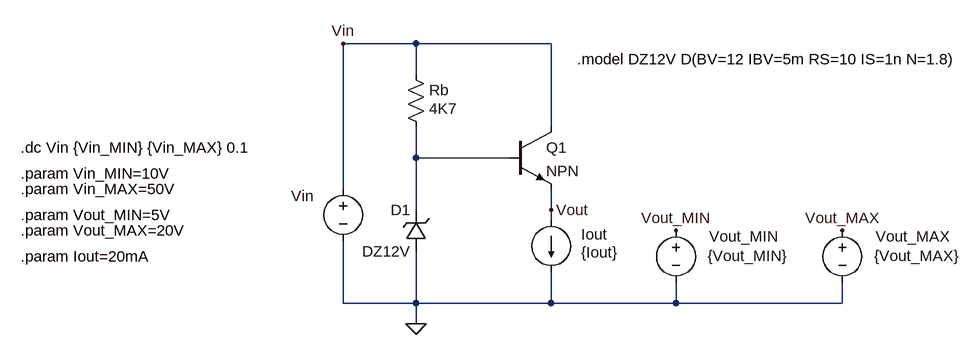
[diagram p0: schematic topology_C.asc]
topology_C.asc, the LTspice schematic file:
Version 4.1
SHEET 1 1432 720
WIRE 432 -48 320 -48
WIRE 640 -48 432 -48
WIRE 432 0 432 -48
WIRE 640 80 640 -48
WIRE 432 128 432 80
WIRE 576 128 432 128
WIRE 320 176 320 -48
WIRE 432 208 432 128
WIRE 640 208 640 176
WIRE 640 224 640 208
WIRE 320 352 320 256
WIRE 432 352 432 272
WIRE 432 352 320 352
WIRE 640 352 640 304
WIRE 640 352 432 352
WIRE 832 352 832 320
WIRE 832 352 640 352
WIRE 1088 352 1088 320
WIRE 1088 352 832 352
WIRE 432 384 432 352
FLAG 320 -48 Vin
FLAG 432 384 0
FLAG 640 208 Vout
FLAG 832 240 Vout_MIN
FLAG 1088 240 Vout_MAX
SYMBOL res 416 -16 R0
WINDOW 3 36 68 Left 2
SYMATTR InstName Rb
SYMATTR Value 4K7
SYMBOL voltage 320 160 R0
WINDOW 123 0 0 Left 0
WINDOW 39 0 0 Left 0
WINDOW 0 -80 27 Left 2
WINDOW 3 -82 66 Left 2
SYMATTR InstName Vin
SYMATTR Value ""
SYMBOL voltage 832 224 R0
WINDOW 123 0 0 Left 0
WINDOW 39 0 0 Left 0
WINDOW 0 51 25 Left 2
WINDOW 3 49 55 Left 2
SYMATTR InstName Vout_MIN
SYMATTR Value {Vout_MIN}
SYMBOL voltage 1088 224 R0
WINDOW 123 0 0 Left 0
WINDOW 39 0 0 Left 0
WINDOW 0 51 25 Left 2
WINDOW 3 49 55 Left 2
SYMATTR InstName Vout_MAX
SYMATTR Value {Vout_MAX}
SYMBOL zener 448 272 R180
WINDOW 0 24 64 Left 2
WINDOW 3 24 0 Left 2
SYMATTR InstName D1
SYMATTR Value DZ12V
SYMBOL npn 576 80 R0
SYMATTR InstName Q1
SYMBOL current 640 224 R0
WINDOW 0 46 22 Left 2
WINDOW 3 46 50 Left 2
WINDOW 123 0 0 Left 0
WINDOW 39 0 0 Left 0
SYMATTR InstName Iout
SYMATTR Value {Iout}
TEXT -176 112 Left 2 !.dc Vin {Vin_MIN} {Vin_MAX} 0.1
TEXT -176 152 Left 2 !.param Vin_MIN=10V
TEXT -176 176 Left 2 !.param Vin_MAX=50V
TEXT -176 216 Left 2 !.param Vout_MIN=5V
TEXT -176 240 Left 2 !.param Vout_MAX=20V
TEXT -176 280 Left 2 !.param Iout=20mA
TEXT 680 -24 Left 2 !.model DZ12V D(BV=12 IBV=5m RS=10 IS=1n N=1.8)

The netlist it stands for:
* topology_C.asc
Rb Vin N001 4K7
Vin Vin 0
Vout_MIN Vout_MIN 0 {Vout_MIN}
Vout_MAX Vout_MAX 0 {Vout_MAX}
D1 0 N001 DZ12V
Q1 Vin N001 Vout 0 NPN
Iout Vout 0 {Iout}
.model D D
.lib standard.dio
.model NPN NPN
.model PNP PNP
.lib standard.bjt
.dc Vin {Vin_MIN} {Vin_MAX} 0.1
.param Vin_MIN=10V
.param Vin_MAX=50V
.param Vout_MIN=5V
.param Vout_MAX=20V
.param Iout=20mA
.model DZ12V D(BV=12 IBV=5m RS=10 IS=1n N=1.8)
.backanno
.end